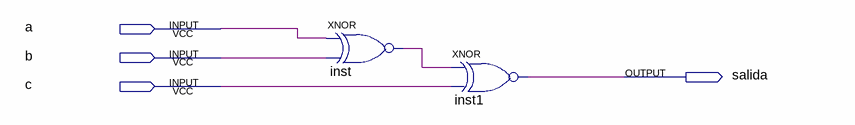
[diagram p0: schematic sheet]
// Quartus schematic XNOR3.bdf as structural Verilog: 2 symbols, 4 pins
module XNOR3 (
  input  a,
  input  b,
  input  c,
  output salida
);

  wire inst_out;

  xnor inst (inst_out, a, b);
  xnor inst1 (salida, inst_out, c);
endmodule
